# EAGLE schematic Relay_Charge_Circuit (EAGLE 9.7.0)
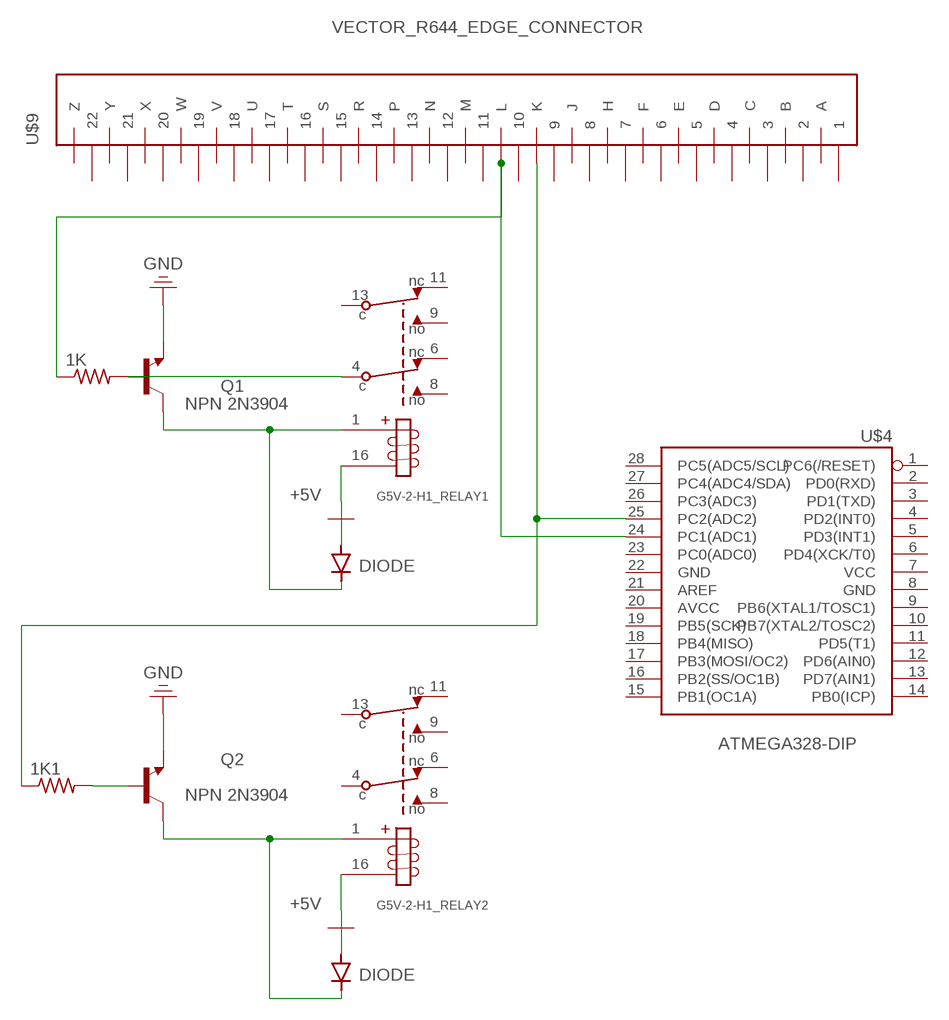
[diagram p0: schematic, sheet 1]

## Parts
1K  R-US_0414/5V  [0414V]
1K1  R-US_0414/5V  [0414V]
G5V-2-H1_RELAY1  RELAY_DPDT  [DIP16_RELAY]
G5V-2-H1_RELAY2  RELAY_DPDT  [DIP16_RELAY]
Q1  NPN 2N3904  NPN__TO92  [TO92]
Q2  NPN 2N3904  NPN__TO92  [TO92]
U$3  DIODE  [DIODE-DO-220AA(SMP)]
U$4  ATMEGA328-DIP  [DIP28]
U$6  DIODE  [DIODE-DO-220AA(SMP)]
U$9  VECTOR_R644_EDGE_CONNECTOR  [VECTOR44]

## Nets
+5V: G5V-2-H1_RELAY1.16 G5V-2-H1_RELAY2.16 U$3.ANODE U$6.ANODE
GND: Q1.3(E) Q2.3(E)
N$8: G5V-2-H1_RELAY1.1 Q1.1(C) U$3.CATHODE
N$9: 1K.2 G5V-2-H1_RELAY1.P1 Q1.2(B)
N$10: 1K.1 U$4.24(PC1(ADC1)) U$9.P$L(L)
N$11: 1K1.2 Q2.2(B)
N$12: 1K1.1 U$4.25(PC2(ADC2)) U$9.P$K(K)
N$13: G5V-2-H1_RELAY2.1 Q2.1(C) U$6.CATHODE
Unconnected: G5V-2-H1_RELAY1.O1 G5V-2-H1_RELAY1.O2 G5V-2-H1_RELAY1.P2 G5V-2-H1_RELAY1.S1 G5V-2-H1_RELAY1.S2 G5V-2-H1_RELAY2.O1 G5V-2-H1_RELAY2.O2 G5V-2-H1_RELAY2.P1 G5V-2-H1_RELAY2.P2 G5V-2-H1_RELAY2.S1 G5V-2-H1_RELAY2.S2 U$4.1(PC6(/RESET)) U$4.2(PD0(RXD)) U$4.3(PD1(TXD)) U$4.4(PD2(INT0)) U$4.5(PD3(INT1)) U$4.6(PD4(XCK/T0)) U$4.7(VCC) U$4.8(GND) U$4.9(PB6(XTAL1/TOSC1)) U$4.10(PB7(XTAL2/TOSC2)) U$4.11(PD5(T1)) U$4.12(PD6(AIN0)) U$4.13(PD7(AIN1)) U$4.14(PB0(ICP)) U$4.15(PB1(OC1A)) U$4.16(PB2(SS/OC1B)) U$4.17(PB3(MOSI/OC2)) U$4.18(PB4(MISO)) U$4.19(PB5(SCK)) U$4.20(AVCC) U$4.21(AREF) U$4.22(GND) U$4.23(PC0(ADC0)) U$4.26(PC3(ADC3)) U$4.27(PC4(ADC4/SDA)) U$4.28(PC5(ADC5/SCL)) U$9.P$1 U$9.P$2 U$9.P$3 U$9.P$4 U$9.P$5 U$9.P$6 U$9.P$7 U$9.P$8 U$9.P$9 U$9.P$10 U$9.P$11 U$9.P$12 U$9.P$13 U$9.P$14 U$9.P$15 U$9.P$16 U$9.P$17 U$9.P$18 U$9.P$19 U$9.P$20 U$9.P$21 U$9.P$22 U$9.P$A(A) U$9.P$B(B) U$9.P$C(C) U$9.P$D(D) U$9.P$E(E) U$9.P$F(F) U$9.P$H(H) U$9.P$J(J) U$9.P$M(M) U$9.P$N(N) U$9.P$P(P) U$9.P$R(R) U$9.P$S(S) U$9.P$T(T) U$9.P$U(U) U$9.P$V(V) U$9.P$W(W) U$9.P$X(X) U$9.P$Y(Y) U$9.P$Z(Z)

## Library data of the parts
1K 1K1 = BeagleBone_Black_Wireless:R-US_: RESISTOR, American symbol
G5V-2-H1_RELAY1 G5V-2-H1_RELAY2 = JDP_created_v7:RELAY_DPDT
Q1 Q2 = Tinkercad:NPN: NPN - Generic
U$3 U$6 = Spark:DIODE
U$4 = JDP_created_v7:ATMEGA328-DIP
U$9 = JDP_created_v7:VECTOR_R644_EDGE_CONNECTOR